# EAGLE design MDTester (EAGLE 6.2)
MCLR: 1
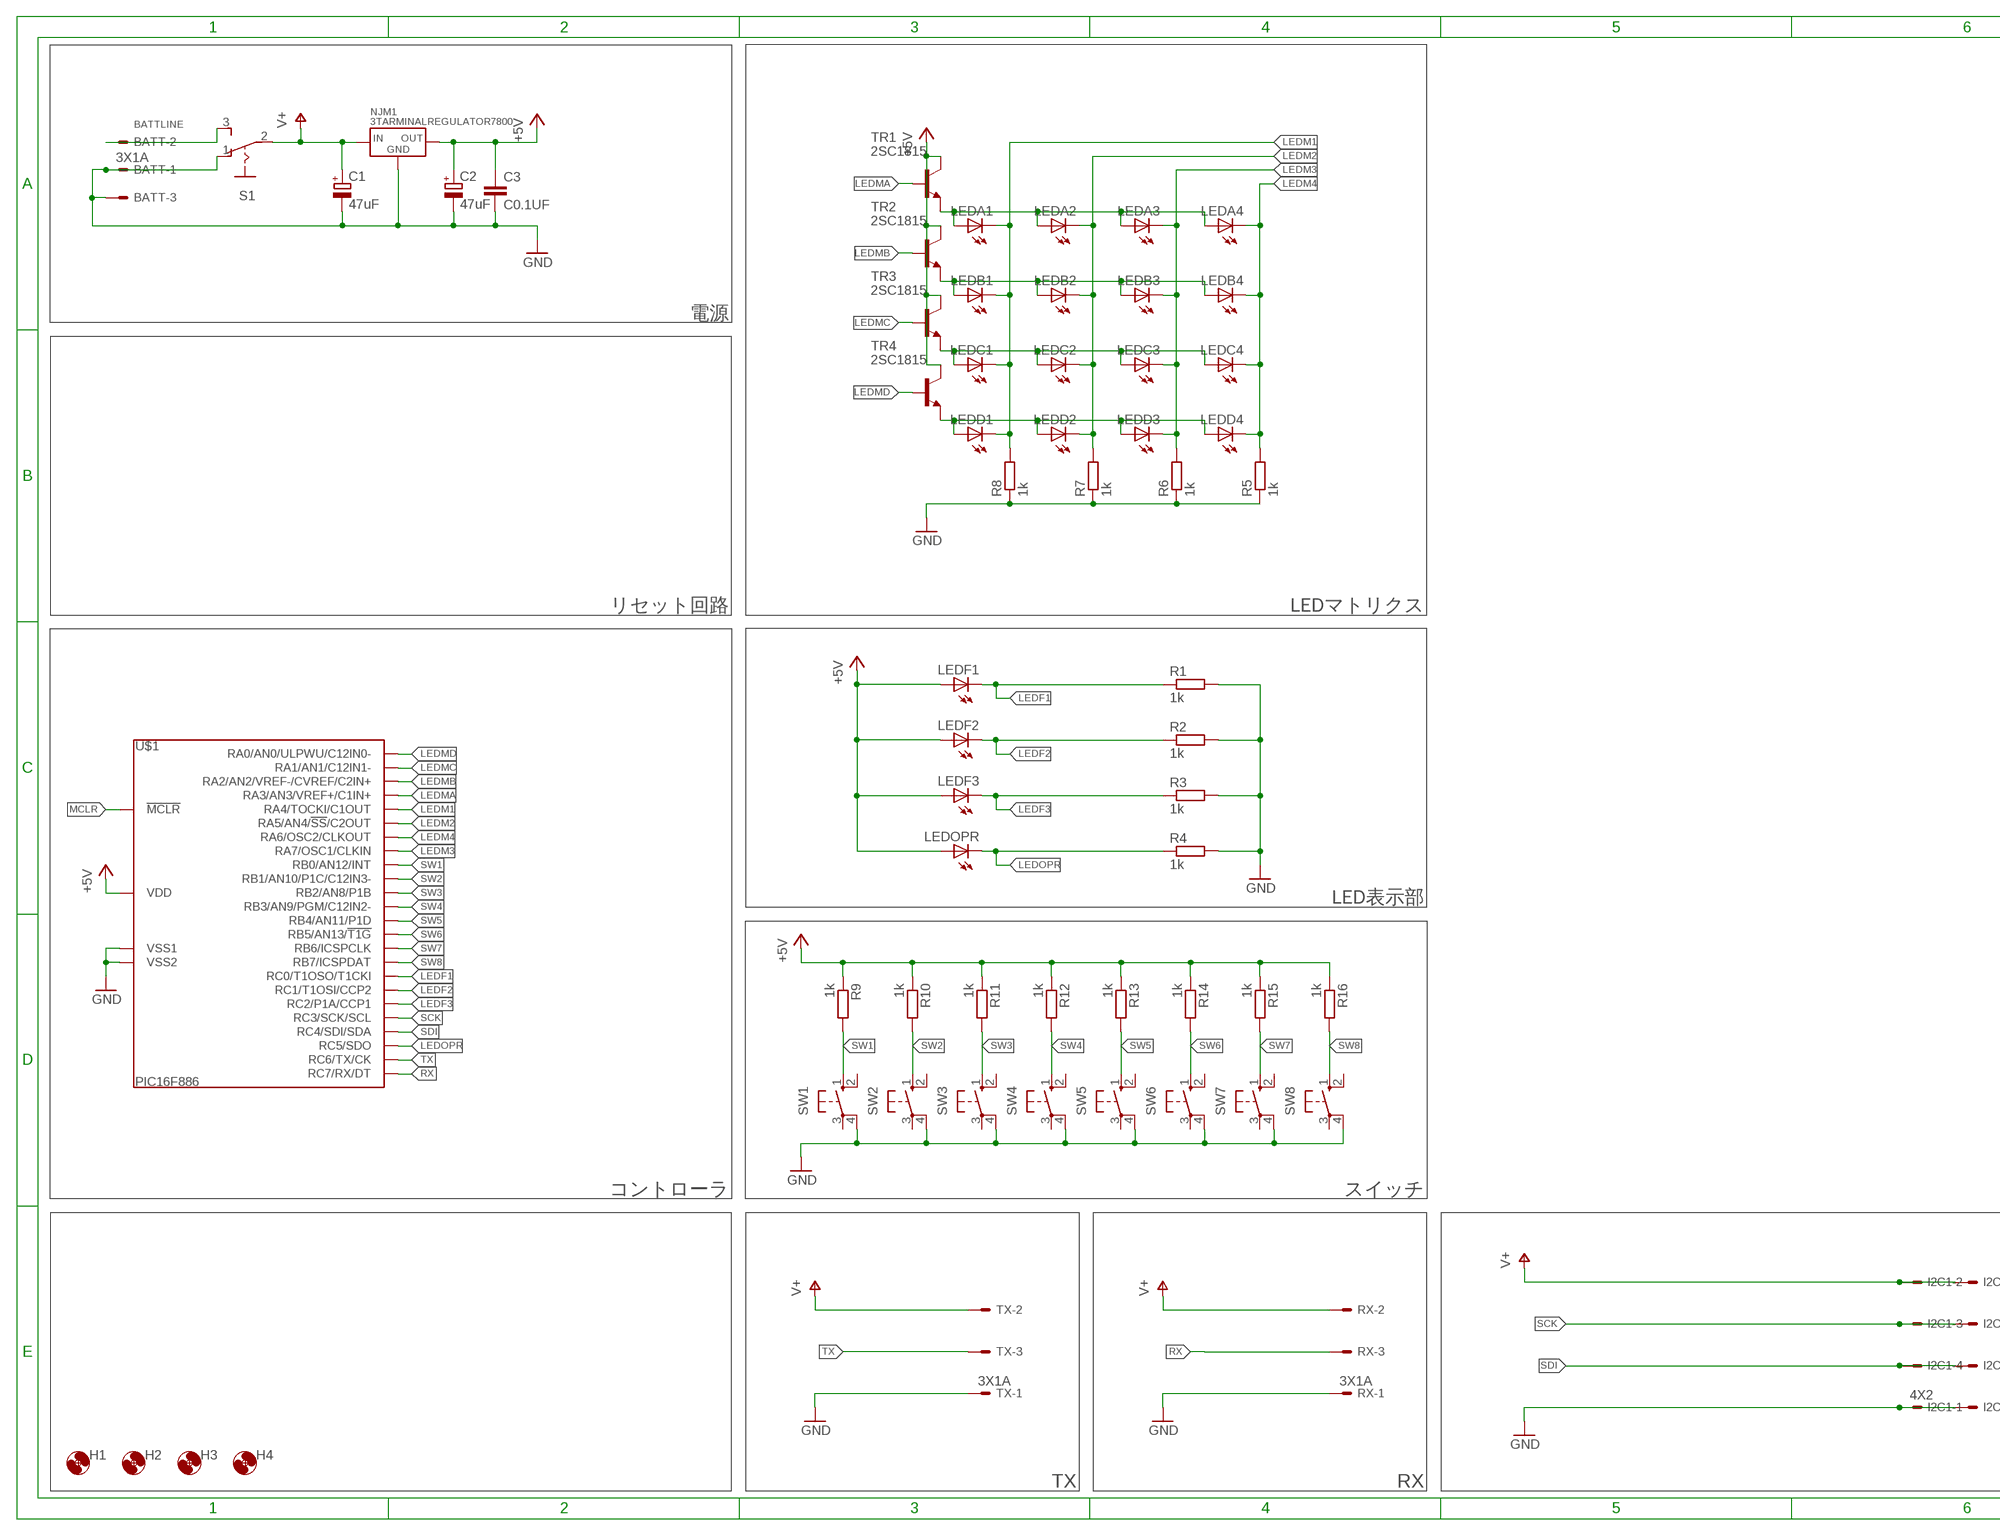
[diagram p0: schematic, sheet 1, part 1 of 2]
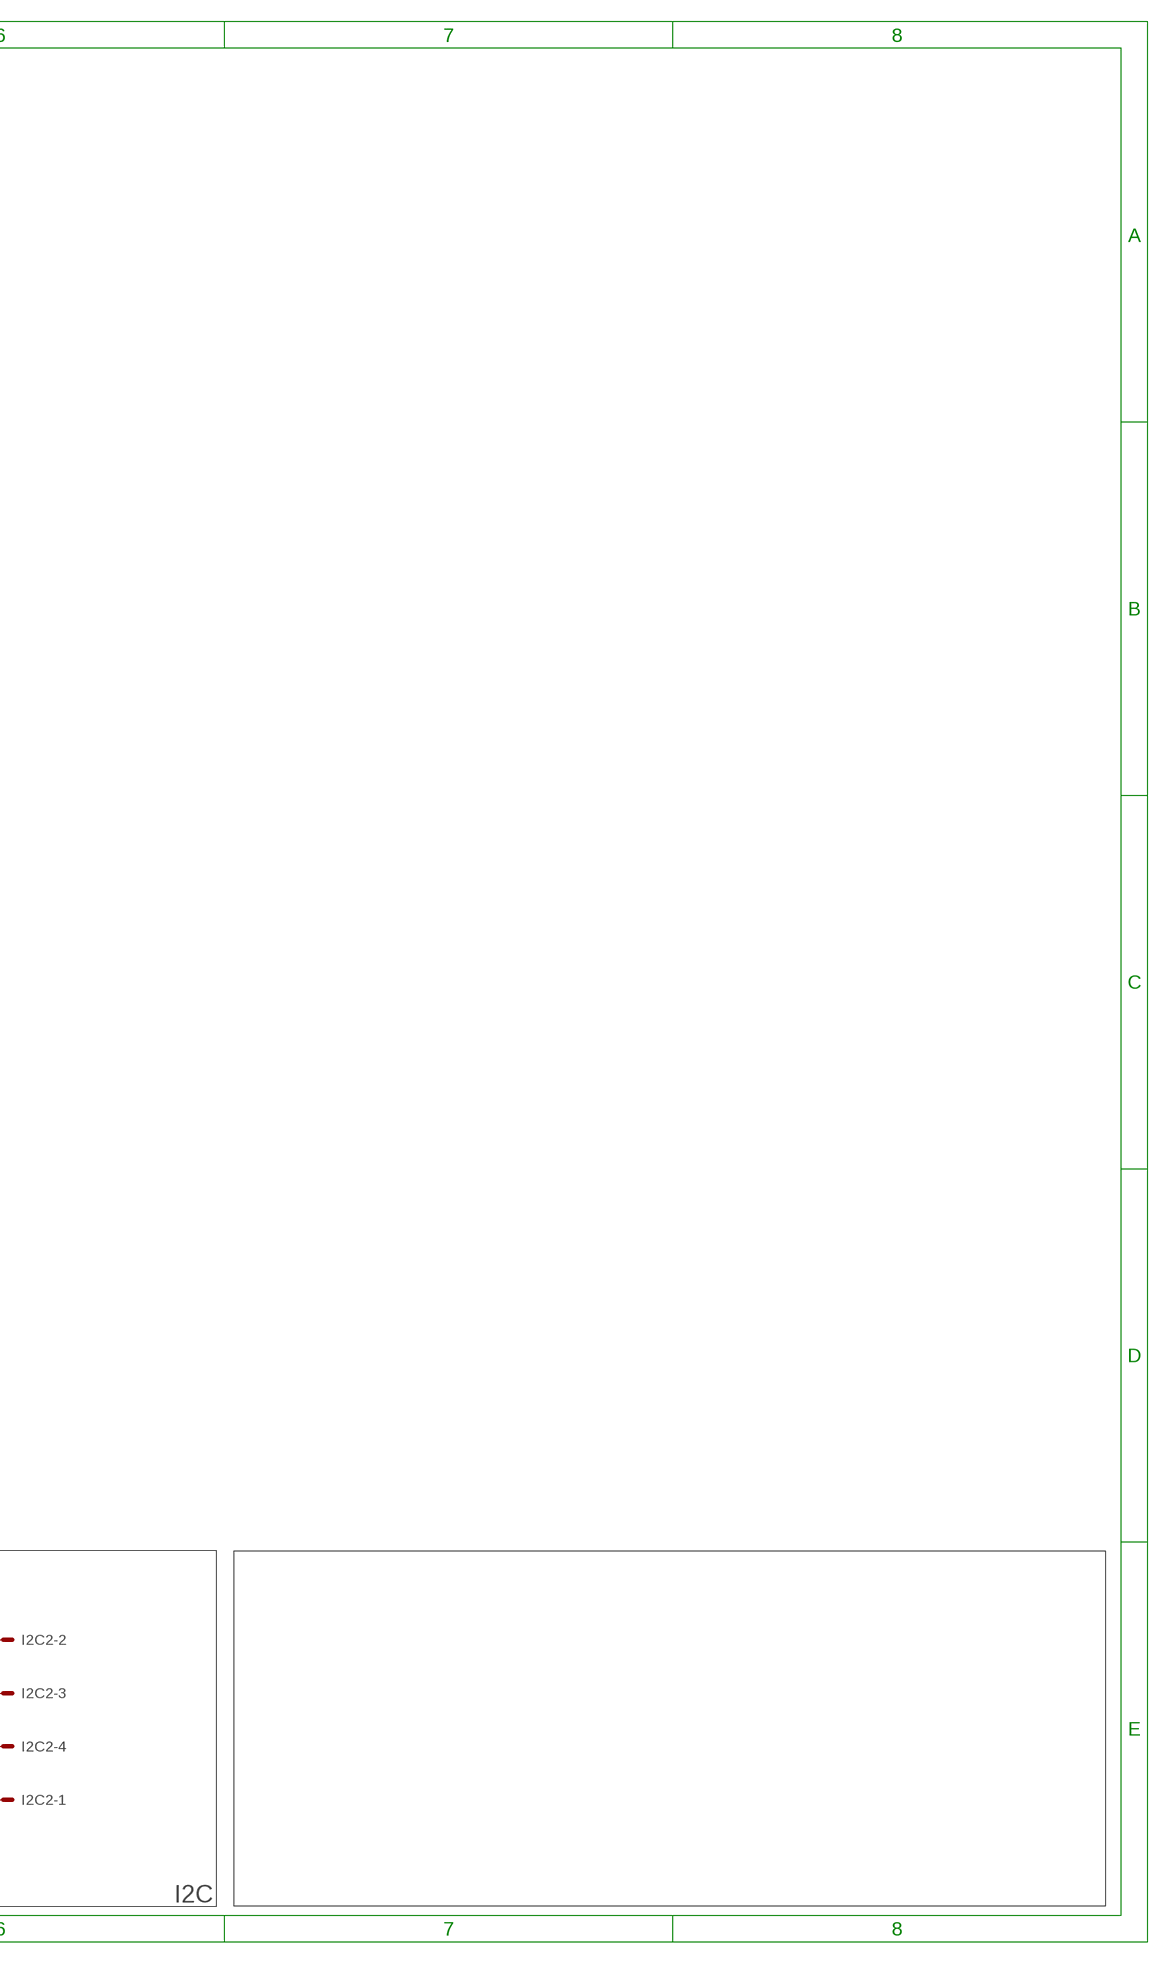
[diagram p1: schematic, sheet 1, part 2 of 2]

## Parts
BATT  3X1A  [37203-62A3-003]
C1  47uF  CPOL-EU2-5MM  [E2-5]
C2  47uF  CPOL-EU2-5MM  [E2-5]
C3  C0.1UF  [C0.1UF]
H1  HOLE3.3M3BOLT  [HOLE3.3]
H2  HOLE3.3M3BOLT  [HOLE3.3]
H3  HOLE3.3M3BOLT  [HOLE3.3]
H4  HOLE3.3M3BOLT  [HOLE3.3]
I2C  4X2  [37208-62A3-004]
LEDA1  LED5MM  [LED5MM]
LEDA2  LED5MM  [LED5MM]
LEDA3  LED5MM  [LED5MM]
LEDA4  LED5MM  [LED5MM]
LEDB1  LED5MM  [LED5MM]
LEDB2  LED5MM  [LED5MM]
LEDB3  LED5MM  [LED5MM]
LEDB4  LED5MM  [LED5MM]
LEDC1  LED5MM  [LED5MM]
LEDC2  LED5MM  [LED5MM]
LEDC3  LED5MM  [LED5MM]
LEDC4  LED5MM  [LED5MM]
LEDD1  LED5MM  [LED5MM]
LEDD2  LED5MM  [LED5MM]
LEDD3  LED5MM  [LED5MM]
LEDD4  LED5MM  [LED5MM]
LEDF1  LED5MM  [LED5MM]
LEDF2  LED5MM  [LED5MM]
LEDF3  LED5MM  [LED5MM]
LEDOPR  LED5MM  [LED5MM]
NJM1  3TARMINALREGULATOR7800  [TO-220]
R1  1k  R-EU_R3216W  [R3216W]
R2  1k  R-EU_R3216W  [R3216W]
R3  1k  R-EU_R3216W  [R3216W]
R4  1k  R-EU_R3216W  [R3216W]
R5  1k  R-EU_R3216W  [R3216W]
R6  1k  R-EU_R3216W  [R3216W]
R7  1k  R-EU_R3216W  [R3216W]
R8  1k  R-EU_R3216W  [R3216W]
R9  1k  R-EU_R3216W  [R3216W]
R10  1k  R-EU_R3216W  [R3216W]
R11  1k  R-EU_R3216W  [R3216W]
R12  1k  R-EU_R3216W  [R3216W]
R13  1k  R-EU_R3216W  [R3216W]
R14  1k  R-EU_R3216W  [R3216W]
R15  1k  R-EU_R3216W  [R3216W]
R16  1k  R-EU_R3216W  [R3216W]
RX  3X1A  [37203-62A3-003]
S1  SLIDESW  [SLIDESW]
SW1  TACTSW  [TACT]
SW2  TACTSW  [TACT]
SW3  TACTSW  [TACT]
SW4  TACTSW  [TACT]
SW5  TACTSW  [TACT]
SW6  TACTSW  [TACT]
SW7  TACTSW  [TACT]
SW8  TACTSW  [TACT]
TR1  2SC1815  [TO92-]
TR2  2SC1815  [TO92-]
TR3  2SC1815  [TO92-]
TR4  2SC1815  [TO92-]
TX  3X1A  [37203-62A3-003]
U$1  PIC16F886  [DIL28]

## Nets
+5V: C2.+ C3.1 LEDF1.A LEDF2.A LEDF3.A LEDOPR.A NJM1.OUT R9.1 R10.1 R11.1 R12.1 R13.1 R14.1 R15.1 R16.1 TR1.C TR2.C TR3.C TR4.C U$1.20(VDD)
BATTLINE: BATT.1-2 S1.3
GND: BATT.1-1 BATT.1-3 C1.- C2.- C3.2 I2C.1-1 I2C.2-1 NJM1.GND R1.2 R2.2 R3.2 R4.2 R5.1 R6.1 R7.1 R8.1 RX.1-1 S1.1 SW1.4(P1) SW2.4(P1) SW3.4(P1) SW4.4(P1) SW5.4(P1) SW6.4(P1) SW7.4(P1) SW8.4(P1) TX.1-1 U$1.8(VSS1) U$1.19(VSS2)
LEDF1: LEDF1.K(C) R1.1 U$1.11(RC0/T1OSO/T1CKI)
LEDF2: LEDF2.K(C) R2.1 U$1.12(RC1/T1OSI/CCP2)
LEDF3: LEDF3.K(C) R3.1 U$1.13(RC2/P1A/CCP1)
LEDM1: LEDA1.K(C) LEDB1.K(C) LEDC1.K(C) LEDD1.K(C) R8.2 U$1.6(RA4/TOCKI/C1OUT)
LEDM2: LEDA2.K(C) LEDB2.K(C) LEDC2.K(C) LEDD2.K(C) R7.2 U$1.7(RA5/AN4/!SS!/C2OUT)
LEDM3: LEDA3.K(C) LEDB3.K(C) LEDC3.K(C) LEDD3.K(C) R6.2 U$1.9(RA7/OSC1/CLKIN)
LEDM4: LEDA4.K(C) LEDB4.K(C) LEDC4.K(C) LEDD4.K(C) R5.2 U$1.10(RA6/OSC2/CLKOUT)
LEDMA: TR1.B U$1.5(RA3/AN3/VREF+/C1IN+)
LEDMB: TR2.B U$1.4(RA2/AN2/VREF-/CVREF/C2IN+)
LEDMC: TR3.B U$1.3(RA1/AN1/C12IN1-)
LEDMD: TR4.B U$1.2(RA0/AN0/ULPWU/C12IN0-)
LEDOPR: LEDOPR.K(C) R4.1 U$1.16(RC5/SDO)
MCLR: U$1.1(!MCLR)
N$26: LEDA1.A LEDA2.A LEDA3.A LEDA4.A TR1.E
N$27: LEDB1.A LEDB2.A LEDB3.A LEDB4.A TR2.E
N$28: LEDC1.A LEDC2.A LEDC3.A LEDC4.A TR3.E
N$29: LEDD1.A LEDD2.A LEDD3.A LEDD4.A TR4.E
RX: RX.1-3 U$1.18(RC7/RX/DT)
SCK: I2C.1-3 I2C.2-3 U$1.14(RC3/SCK/SCL)
SDI: I2C.1-4 I2C.2-4 U$1.15(RC4/SDI/SDA)
SW1: R9.2 SW1.1(S) U$1.21(RB0/AN12/INT)
SW2: R10.2 SW2.1(S) U$1.22(RB1/AN10/P1C/C12IN3-)
SW3: R11.2 SW3.1(S) U$1.23(RB2/AN8/P1B)
SW4: R12.2 SW4.1(S) U$1.24(RB3/AN9/PGM/C12IN2-)
SW5: R13.2 SW5.1(S) U$1.25(RB4/AN11/P1D)
SW6: R14.2 SW6.1(S) U$1.26(RB5/AN13/!T1G)
SW7: R15.2 SW7.1(S) U$1.27(RB6/ICSPCLK)
SW8: R16.2 SW8.1(S) U$1.28(RB7/ICSPDAT)
TX: TX.1-3 U$1.17(RC6/TX/CK)
V+: C1.+ I2C.1-2 I2C.2-2 NJM1.IN RX.1-2 S1.2 TX.1-2
Unconnected: SW1.2(S1) SW1.3(P) SW2.2(S1) SW2.3(P) SW3.2(S1) SW3.3(P) SW4.2(S1) SW4.3(P) SW5.2(S1) SW5.3(P) SW6.2(S1) SW6.3(P) SW7.2(S1) SW7.3(P) SW8.2(S1) SW8.3(P)

## Notes on the sheet
- 電源
- リセット回路 | LEDマトリクス
- LED表示部
- コントローラ | スイッチ
- TX | RX | I2C

## Library data of the parts
BATT RX TX = 3M_372xx:3X1
C1 C2 = FP-21T for MITS:CPOL-EU2
C3 = FP-21T for MITS:C0.1UF
H1-H4 = Hole:HOLE3.3
I2C = 3M_372xx:4X2
LEDA1-LEDA4 LEDB1-LEDB4 LEDC1-LEDC4 LEDD1-LEDD4 LEDF1-LEDF3 LEDOPR = FP-21T for MITS:LED: LED OSRAM: - CHIPLED LG R971, LG N971, LY N971, LG Q971, LY Q971, LO R971, LY R971 LH N974, LH R974 LS Q976, LO Q976, LY Q976 LO Q996 - Hyper CHIPLED LW Q18S LB Q993, LB Q99A, LB R99A - SideLED LS A670, LO A670, LY A670, LG A670, LP A670 LB A673, LV A673, LT A673, LW A673 LH A674 LY A675 LS A676, LA A676, LO A676, LY A676, LW A676 LS A679, LY A679, LG A679 - Hyper Micro SIDELED® LS Y876, LA Y876, LO Y876, LY Y876 LT Y87S - SmartLED LW L88C, LW L88S LB L89C, LB L89S, LG L890 LS L89K, LO L89K, LY L89K LS L896, LA L896, LO L896, LY L896 - TOPLED LS T670, LO T670, LY T670, LG T670, LP T670 LSG T670, LSP T670, LSY T670, LOP T670, LYG T670 LG T671, LOG T671, LSG T671 LB T673, LV T673, LT T673, LW T673 LH T674 LS T676, LA T676, LO T676, LY T676, LB T676, LH T676, LSB T676, LW T676 LB T67C, LV T67C, LT T67C, LS T67K, LO T67K, LY T67K, LW E67C LS E67B, LA E67B, LO E67B, LY E67B, LB E67C, LV E67C, LT E67C LW T67C LS T679, LY T679, LG T679 LS T770, LO T770, LY T770, LG T770, LP T770 LB T773, LV T773, LT T773, LW T773 LH T774 LS E675, LA E675, LY E675, LS T675 LS T776, LA T776, LO T776, LY T776, LB T776 LHGB T686 LT T68C, LB T68C - Hyper Mini TOPLED® LB M676 - Mini TOPLED Santana® LG M470 LS M47K, LO M47K, LY M47K Source: http://www.osram.convergy.de - LUMILED® LXK2-PW12-R00, LXK2-PW12-S00, LXK2-PW14-U00, LXK2-PW14-V00 LXK2-PM12-R00, LXK2-PM12-S00, LXK2-PM14-U00 LXK2-PE12-Q00, LXK2-PE12-R00, LXK2-PE12-S00, LXK2-PE14-T00, LXK2-PE14-U00 LXK2-PB12-K00, LXK2-PB12-L00, LXK2-PB12-M00, LXK2-PB14-N00, LXK2-PB14-P00, LXK2-PB14-Q00 LXK2-PR12-L00, LXK2-PR12-M00, LXK2-PR14-Q00, LXK2-PR14-R00 LXK2-PD12-Q00, LXK2-PD12-R00, LXK2-PD12-S00 LXK2-PH12-R00, LXK2-PH12-S00 LXK2-PL12-P00, LXK2-PL12-Q00, LXK2-PL12-R00 Source: www.luxeon.com
NJM1 = regulator:3TARMINALREGULATOR
R1-R16 = rcl:R-EU_: RESISTOR, European symbol
S1 = switch:SLIDESW
SW1-SW8 = pushsw:TACTSW
TR1-TR4 = FP-21T for MITS:2SC1815
U$1 = PIC:PIC16F886

## Board
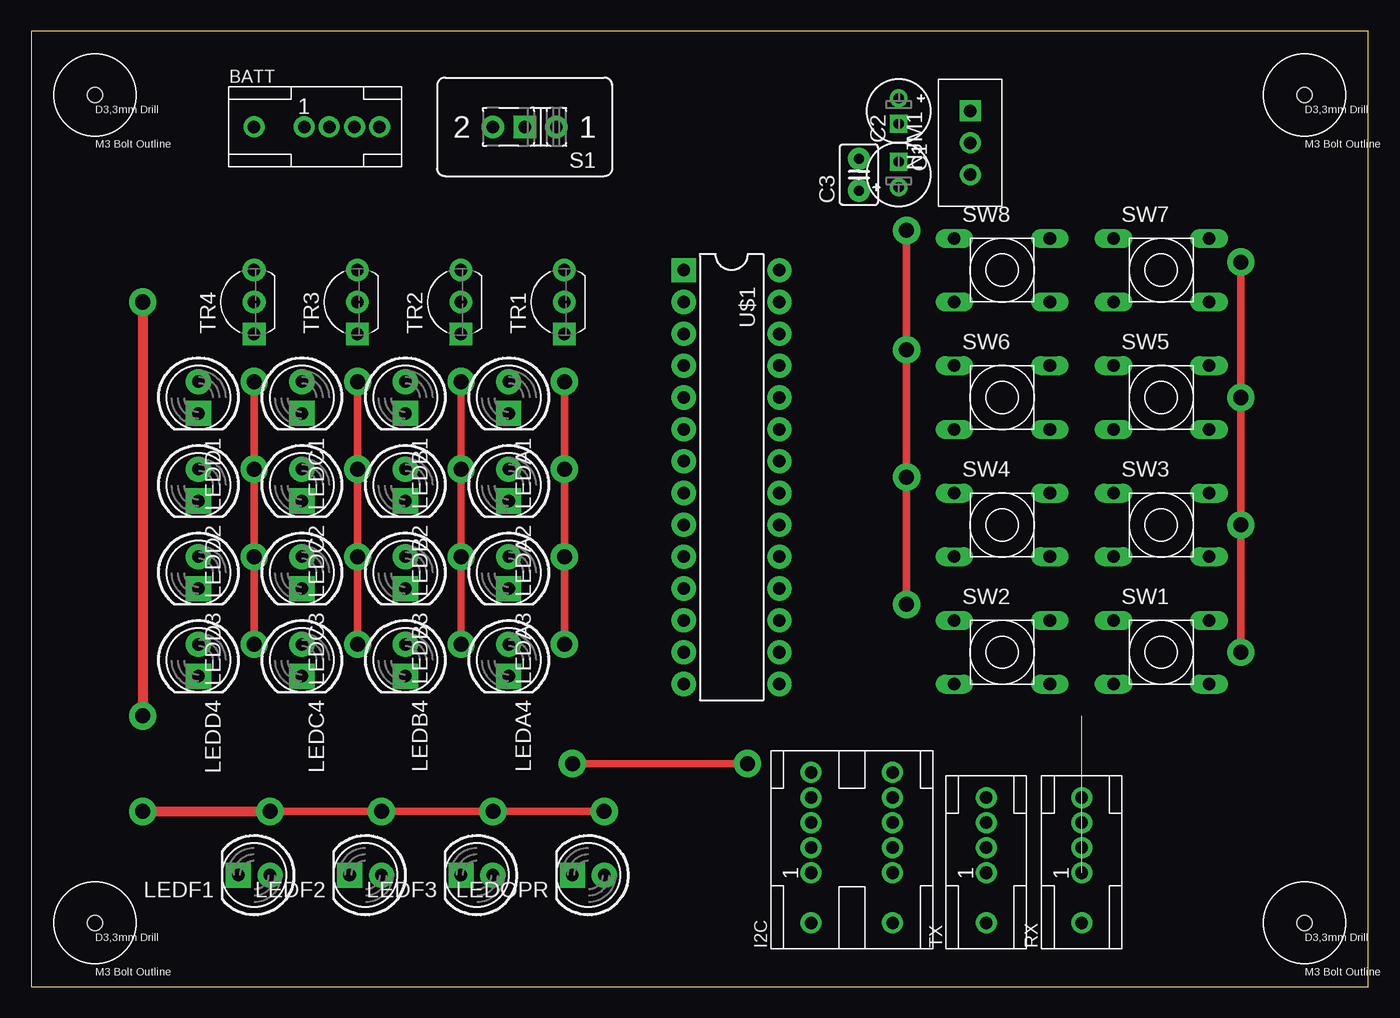
[diagram p2: board, top side]
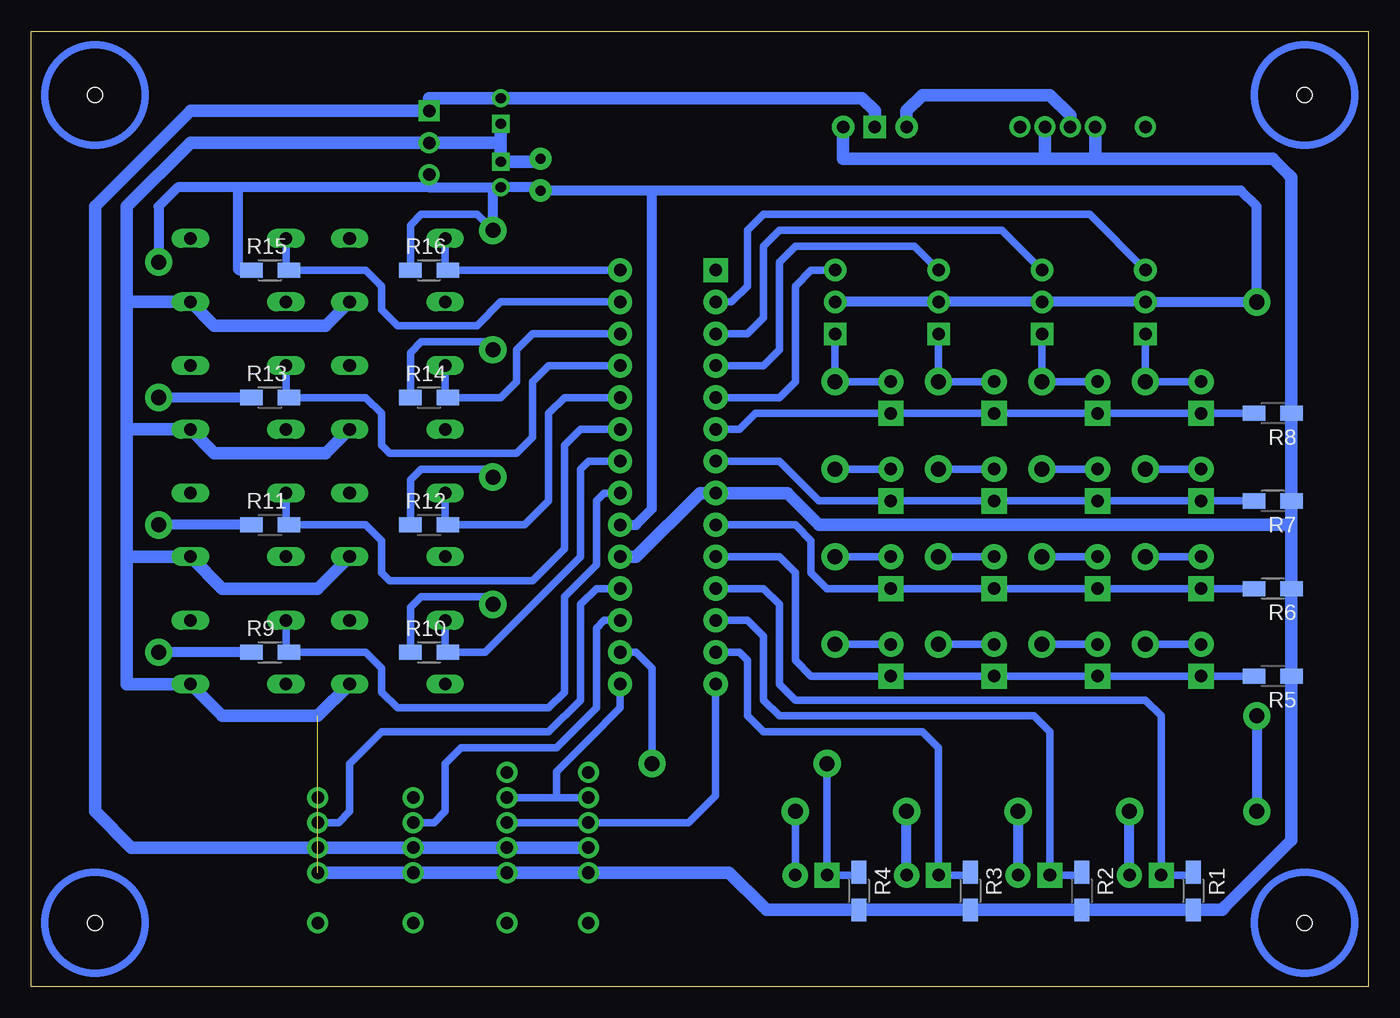
[diagram p3: board, bottom side, seen from below]

Size 106.68 x 76.2 mm. Coordinates in mm from the lower left corner, seen from the top.
Outline: 0,0 106.68,0 106.68,76.2 0,76.2 0,0
Copper layers (1*16): Top 0.035mm / dielectric 1.5mm / Bottom 0.035mm
Design rules: minimum track width 0.15mm, minimum drill 0.3mm, track to track 0.25mm, track to pad 0.25mm, pad to pad 0.25mm, via to via 0.25mm, smd to smd 0.2mm, copper to edge 100mil, drill to drill 0.45mm, minimum pad ring 0.15mm, minimum via ring 0.15mm, stop-mask expansion 4mil, vias tented up to drill 0mil, thermal gap 0.15mm

### Footprints (pad centres in the part's own frame; a part is rotated, then mirrored left to right if it is on the bottom)
37203-62A3-003 = drill 1 pad 1.676: 1-1 0,4; 1-2 0,6; 1-3 0,8; P$1 0,0; P$2 0,10
E2-5 = drill 0.8 pad 1.422: + -1.016,0 | drill 0.8 pad 1.422 square: - 1.016,0
C0.1UF = drill 0.8 pad 1.778: 1 -1.27,0; 2 1.27,0
HOLE3.3 = hole 1.2: 0,0
37208-62A3-004 = drill 1 pad 1.676: 1-1 0,4; 1-2 0,6; 1-3 0,8; 1-4 0,10; 2-1 6.5,4; 2-2 6.5,6; 2-3 6.5,8; 2-4 6.5,10; P$1 0,0; P$2 0,12; P$3 6.5,0; P$4 6.5,12
LED5MM = drill 1 pad 2: A -1.27,0 | drill 1 pad 2 square: K 1.27,0
TO-220 = drill 1 pad 1.676: GND 0,0; OUT 2.54,0 | drill 1 pad 1.676 square: IN -2.54,0
R3216W = smd 1.8 x 1.2: 1 -1.499,0; 2 1.499,0
SLIDESW = drill 1 pad 1.8: 1 -2.54,0; 3 2.54,0 | drill 1 pad 1.8 square: 2 0,0
TACT = drill 1 long: 1 -3.81,2.54; 2 3.81,2.54; 3 -3.81,-2.54; 4 3.81,-2.54
TO92- = drill 1 pad 1.8: B 2.54,0; C 0,0 | drill 1 pad 1.8 square: E -2.54,0
DIL28 = drill 1 pad 1.93 square: 1 -16.51,-3.81 | drill 1 pad 1.93: 2 -13.97,-3.81; 3 -11.43,-3.81; 4 -8.89,-3.81; 5 -6.35,-3.81; 6 -3.81,-3.81; 7 -1.27,-3.81; 8 1.27,-3.81; 9 3.81,-3.81; 10 6.35,-3.81; 11 8.89,-3.81; 12 11.43,-3.81; 13 13.97,-3.81; 14 16.51,-3.81; 15 16.51,3.81; 16 13.97,3.81; 17 11.43,3.81; 18 8.89,3.81; 19 6.35,3.81; 20 3.81,3.81; 21 1.27,3.81; 22 -1.27,3.81; 23 -3.81,3.81; 24 -6.35,3.81; 25 -8.89,3.81; 26 -11.43,3.81; 27 -13.97,3.81; 28 -16.51,3.81

### Placement (x,y rotation side)
BATT  17.78,68.58 270 top
C1  69.22,69.85 270 top
C2  69.22,64.77 90 top
C3  66.04,64.77 90 top
H1  5.08,5.08 0 top
H2  5.08,71.12 0 top
H3  101.6,71.12 0 top
H4  101.6,5.08 0 top
I2C  62.23,5.08 0 top
LEDA1  38.1,46.99 270 top
LEDA2  38.1,40.01 270 top
LEDA3  38.1,33.02 270 top
LEDA4  38.1,26.04 270 top
LEDB1  29.84,46.99 270 top
LEDB2  29.84,40.01 270 top
LEDB3  29.84,33.02 270 top
LEDB4  29.84,26.04 270 top
LEDC1  21.59,46.99 270 top
LEDC2  21.59,40.01 270 top
LEDC3  21.59,33.02 270 top
LEDC4  21.59,26.04 270 top
LEDD1  13.34,46.99 270 top
LEDD2  13.34,40.01 270 top
LEDD3  13.34,33.02 270 top
LEDD4  13.34,26.04 270 top
LEDF1  17.78,8.89 180 top
LEDF2  26.67,8.89 180 top
LEDF3  35.56,8.89 180 top
LEDOPR  44.45,8.89 180 top
NJM1  74.93,67.31 270 top
R1  13.97,7.62 270 bottom
R2  22.86,7.62 270 bottom
R3  31.75,7.62 270 bottom
R4  40.64,7.62 270 bottom
R5  7.62,24.77 180 bottom
R6  7.62,31.75 180 bottom
R7  7.62,38.73 180 bottom
R8  7.62,45.72 180 bottom
R9  87.63,26.67 0 bottom
R10  74.93,26.67 0 bottom
R11  87.63,36.83 0 bottom
R12  74.93,36.83 0 bottom
R13  87.63,46.99 0 bottom
R14  74.93,46.99 0 bottom
R15  87.63,57.15 0 bottom
R16  74.93,57.15 0 bottom
RX  83.82,5.08 0 top
S1  39.37,68.58 180 top
SW1  90.17,26.67 0 top
SW2  77.47,26.67 0 top
SW3  90.17,36.83 0 top
SW4  77.47,36.83 0 top
SW5  90.17,46.99 0 top
SW6  77.47,46.99 0 top
SW7  90.17,57.15 0 top
SW8  77.47,57.15 0 top
TR1  42.55,54.61 90 top
TR2  34.29,54.61 90 top
TR3  26.04,54.61 90 top
TR4  17.78,54.61 90 top
TX  76.2,5.08 0 top
U$1  55.88,40.64 270 top

### Tracks (layer width: path | path; a pad name or v marks a point on that pad's centre or on a via)
+5V  (via drill 1.2 pad 2.18)
  Top 0.61: v19.05,13.97 v27.94,13.97 v36.83,13.97 v45.72,13.97 | v69.85,60.33 v69.85,50.8 v69.85,40.64 v69.85,30.48 | v96.52,26.67 v96.52,36.83 v96.52,46.99 v96.52,57.78
  Top 0.813: v8.89,54.61 v8.89,21.59 | v8.89,13.97 v19.05,13.97
  Bottom 0.61: v45.72,13.97 LEDOPR.A | R10.1 76.43,30.25 75.56,31.11 70.48,31.11 v69.85,30.48 | R14.1 76.43,50.57 75.56,51.44 70.48,51.44 v69.85,50.8 | R16.1 76.43,60.73 75.56,61.59 71.12,61.59 v69.85,60.33 | R12.1 76.43,40.41 75.56,41.27 70.48,41.27 v69.85,40.64
  Bottom 0.813: TR1.C TR2.C TR3.C TR4.C v8.89,54.61 8.89,62.23 10.16,63.5 57.15,63.5 | LEDF1.A v19.05,13.97 | v27.94,13.97 LEDF2.A | LEDF3.A v36.83,13.97 | v8.89,21.59 v8.89,13.97 | U$1.20 58.42,36.83 57.15,38.1 57.15,63.5 | R15.1 90.17,57.15 90.17,63.75 | R9.1 v96.52,26.67 | R11.1 v96.52,36.83 | R13.1 v96.52,46.99 | 90.17,63.75 95,63.75 96.52,62.23 v96.52,57.78 | NJM1.OUT 74.93,63.75 | 74.93,63.75 69.85,63.75 | 69.85,63.75 C2.+ | 69.85,63.75 66.04,63.75 C3.1 57.15,63.5 | 74.93,63.75 90.17,63.75 | v69.85,60.33 69.85,63.75
BATTLINE
  Bottom 1.016: BATT.1-2 23.78,69.5 25.4,71.12 35.56,71.12 36.83,69.85 S1.3
GND  (1 unrouted)
  Bottom 1.016: 6.12,36.83 R7.1 R8.1 6.12,64.54 6.35,64.77 7.62,66.04 16.51,66.04 | 6.12,36.83 R6.1 R5.1 6.12,11.66 11.43,6.35 11.66,6.12 R1.2 R2.2 R3.2 R4.2 48.03,6.12 48.26,6.35 50.99,9.08 I2C.1-1 I2C.2-1 TX.1-1 RX.1-1 | 6.12,36.83 43.81,36.83 46.35,39.37 U$1.8 53.34,39.37 58.42,34.29 U$1.19 | 21.78,66.04 16.51,66.04 | BATT.1-3 25.78,66.04 | 25.78,66.04 20.32,66.04 | 20.32,66.04 21.78,66.04 | S1.1 41.91,66.04 25.78,66.04 | 25.78,66.04 21.78,66.04 | 21.78,66.04 25.78,66.04 | 25.78,66.04 20.32,66.04 | 99.06,44.45 SW5.4 92.08,42.55 83.19,42.55 SW6.4 | 99.06,44.45 99.06,52.7 99.06,54.61 | 99.06,34.29 SW3.4 91.44,31.75 83.82,31.75 SW4.4 | 99.06,34.29 99.06,42.55 99.06,44.45 | 99.06,34.29 99.06,31.75 99.06,24.13 SW1.4 91.44,21.59 83.82,21.59 SW2.4 | SW8.4 83.19,52.7 92.08,52.7 SW7.4 99.06,54.61 | BATT.1-1 21.78,66.04 | 21.78,66.04 16.51,66.04 | 69.22,67.31 C2.- 66.04,65.79 C3.2 | 69.22,67.31 69.85,67.31 | 69.85,67.31 NJM1.GND 93.98,67.31 99.06,62.23 99.06,54.61 | C1.- 69.22,67.31 | 69.22,67.31 69.85,67.31
LEDF1
  Bottom 0.61: U$1.11 48.26,31.75 46.99,30.48 46.99,26.04 46.99,24.13 45.72,22.86 17.78,22.86 16.51,21.59 LEDF1.K 13.97,8.89 R1.1
LEDF2
  Bottom 0.61: U$1.12 49.53,29.21 48.26,27.94 48.26,22.86 46.99,21.59 26.67,21.59 25.4,20.32 LEDF2.K 22.86,8.89 R2.1
LEDF3
  Bottom 0.61: U$1.13 50.16,26.67 49.53,26.04 49.53,21.59 48.26,20.32 35.56,20.32 34.29,19.05 LEDF3.K 31.75,8.89 R3.1
LEDM1
  Bottom 0.61: R8.2 LEDD1.K LEDC1.K LEDB1.K LEDA1.K 48.9,45.72 50.16,44.45 U$1.6
LEDM2
  Bottom 0.61: R7.2 LEDD2.K LEDC2.K LEDB2.K LEDA2.K 43.81,38.73 46.99,41.91 U$1.7
LEDM3
  Bottom 0.61: R6.2 LEDD3.K LEDC3.K LEDB3.K LEDA3.K 43.18,31.75 44.45,33.02 44.45,35.56 45.72,36.83 U$1.9
LEDM4
  Bottom 0.61: R5.2 LEDD4.K LEDC4.K LEDB4.K LEDA4.K 44.45,24.77 45.72,26.04 45.72,33.02 46.99,34.29 U$1.10
LEDMA
  Bottom 0.61: TR1.B 44.45,57.15 45.72,55.88 45.72,48.26 46.99,46.99 U$1.5
LEDMB
  Bottom 0.61: U$1.4 48.26,49.53 46.99,50.8 46.99,57.78 45.72,59.05 36.2,59.05 TR2.B
LEDMC
  Bottom 0.61: U$1.3 49.53,52.07 48.26,53.34 48.26,59.05 46.99,60.33 29.21,60.33 TR3.B
LEDMD
  Bottom 0.61: U$1.2 50.8,54.61 49.53,55.88 49.53,60.33 48.26,61.59 22.23,61.59 TR4.B
LEDOPR  (via drill 1.2 pad 2.18)
  Top 0.61: v57.15,17.78 v43.18,17.78
  Bottom 0.61: U$1.16 58.42,26.67 57.15,25.4 v57.15,17.78 | v43.18,17.78 LEDOPR.K 40.64,8.89 R4.1
N$26  (via drill 1.2 pad 2.18)
  Top 0.61: v42.55,48.26 v42.55,41.27 v42.55,34.29 v42.55,27.3
  Bottom 0.61: TR1.E v42.55,48.26 LEDA1.A | v42.55,41.27 LEDA2.A | LEDA3.A v42.55,34.29 | LEDA4.A v42.55,27.3
N$27  (via drill 1.2 pad 2.18)
  Top 0.61: v34.29,48.26 v34.29,41.27 v34.29,34.29 v34.29,27.3
  Bottom 0.61: TR2.E v34.29,48.26 LEDB1.A | v34.29,41.27 LEDB2.A | LEDB3.A v34.29,34.29 | LEDB4.A v34.29,27.3
N$28  (via drill 1.2 pad 2.18)
  Top 0.61: v26.04,48.26 v26.04,41.27 v26.04,34.29 v26.04,27.3
  Bottom 0.61: TR3.E v26.04,48.26 LEDC1.A | v26.04,41.27 LEDC2.A | LEDC3.A v26.04,34.29 | LEDC4.A v26.04,27.3
N$29  (via drill 1.2 pad 2.18)
  Top 0.61: v17.78,48.26 v17.78,41.27 v17.78,34.29 v17.78,27.3
  Bottom 0.61: TR4.E v17.78,48.26 LEDD1.A | v17.78,41.27 LEDD2.A | LEDD3.A v17.78,34.29 | LEDD4.A v17.78,27.3
RX
  Bottom 0.61: U$1.18 61.59,31.75 62.87,30.48 62.87,28.57 62.87,22.86 65.41,20.32 72.39,20.32 78.74,20.32 81.28,17.78 81.28,13.97 82.17,13.08 RX.1-3
SCK
  Bottom 0.61: I2C.2-3 I2C.1-3 54.23,13.08 53.34,13.97 52.07,15.24 U$1.14
SDI
  Bottom 0.61: I2C.1-4 64.77,15.08 | 64.77,15.08 I2C.2-4 | U$1.15 59.69,22.23 62.23,19.68 63.5,18.41 64.77,17.14 64.77,15.08
SW1
  Bottom 0.61: SW1.1 86.36,26.67 R9.2 80.01,26.67 78.74,25.4 78.74,23.5 77.47,22.23 71.75,22.23 65.41,22.23 64.14,23.5 64.14,31.11 61.59,33.66 61.59,38.73 60.96,39.37 U$1.21
SW2
  Bottom 0.61: U$1.22 62.23,41.91 62.87,41.27 62.87,34.29 70.48,26.67 R10.2 73.66,26.67 SW2.1
SW3
  Bottom 0.61: U$1.23 62.87,44.45 64.14,43.18 64.14,34.92 66.67,32.38 78.11,32.38 78.74,33.02 78.74,35.56 80.01,36.83 R11.2 86.36,36.83 SW3.1
SW4
  Bottom 0.61: U$1.24 64.14,46.99 65.41,45.72 65.41,38.73 67.31,36.83 69.85,36.83 R12.2 73.66,36.83 SW4.1
SW5
  Bottom 0.61: SW5.1 86.36,46.99 R13.2 80.01,46.99 78.74,45.72 78.74,43.18 78.11,42.55 67.94,42.55 66.67,43.81 66.67,48.26 65.41,49.53 U$1.25
SW6
  Bottom 0.61: SW6.1 73.66,46.99 R14.2 69.22,46.99 67.94,48.26 67.94,50.8 66.67,52.07 U$1.26
SW7
  Bottom 0.61: U$1.27 69.22,54.61 71.12,52.7 77.47,52.7 78.74,53.98 78.74,55.88 80.01,57.15 R15.2 86.36,57.15 SW7.1
SW8
  Bottom 0.61: SW8.1 73.66,57.15 R16.2 U$1.28
TX
  Bottom 0.61: U$1.17 60.96,29.21 61.59,28.57 61.59,22.23 62.23,21.59 63.5,20.32 64.77,19.05 71.12,19.05 72.39,19.05 73.66,17.78 73.66,13.97 74.55,13.08 TX.1-3
V+
  Bottom 1.016: S1.2 39.37,69.85 40.39,70.87 C1.+ 74.93,70.87 NJM1.IN 93.98,69.85 101.6,62.23 101.6,13.97 98.71,11.08 RX.1-2 TX.1-2 I2C.2-2 I2C.1-2